# Altium schematic sheet Master MicroController Port C.SchDoc: Master Micro Controller Port C Pin Out
size A4; DocumentNumber: 18; SheetNumber: 18; SheetTotal: 54
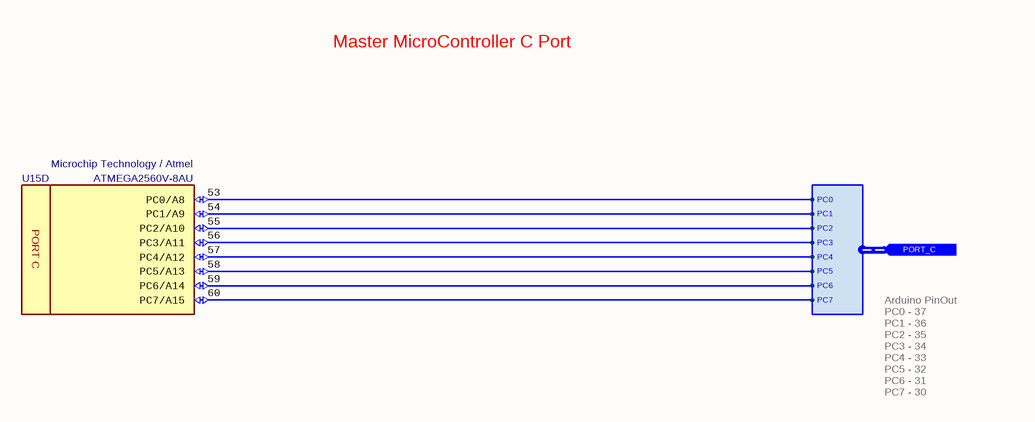
[diagram p0: Master MicroController Port C.SchDoc]

## Parts
U15  Manufacturer Part Number: ATMEGA2560V-8AU  Manufacturer Name: Microchip Technology / Atmel  [TQFP100]  (hidden comment: 8-bit MicroController)  (part D of 15)

## Ports
PORT_C (in, harness PORT_C)

## Harnesses
PORT_C: PC0, PC1, PC2, PC3, PC4, PC5, PC7, PC6

## Nets
NetU15_53: U15.53(PC0/A8) ; port PORT_C.PC0
NetU15_54: U15.54(PC1/A9) ; port PORT_C.PC1
NetU15_55: U15.55(PC2/A10) ; port PORT_C.PC2
NetU15_56: U15.56(PC3/A11) ; port PORT_C.PC3
NetU15_57: U15.57(PC4/A12) ; port PORT_C.PC4
NetU15_58: U15.58(PC5/A13) ; port PORT_C.PC5
NetU15_59: U15.59(PC6/A14) ; port PORT_C.PC6
NetU15_60: U15.60(PC7/A15) ; port PORT_C.PC7

## Notes on the sheet
- Master MicroController C Port
- Arduino PinOut
  PC0 - 37
  PC1 - 36
  PC2 - 35
  PC3 - 34
  PC4 - 33
  PC5 - 32
  PC6 - 31
  PC7 - 30
- Engineer
- All Rights are reserved to Customer and Engineer. [2021]
- Size:
- Date:
- A4
- Project :
- Time:
- Sheet
- of
- Customer
- Product ID
- Module ID
- Version
- File:
- Revision
- (in symbol IC - ATMEGA2560V-8AU, part D) PORT C

## Library data of the parts
U15 = IC - ATMEGA2560V-8AU: 8-bit Microcontrollers - MCU 256kB Flash 4kB EEPROM 86 I/O Pins; Supply Voltage - Min: 2V7; Supply Voltage - Max: 5.5V; Height: 1mm; ComponentLink1Description: DataSheet; ComponentLink1URL: https://eu.mouser.com/datasheet/2/268/Atmel-2549-8-bit-AVR-Microcontroller-ATmega640-128-1315286.pdf; ROHS: Yes; Minimum Operating Temperature: -40; Maximum Operating Temperature: +85; ComponentLink2Description: Mouser; ComponentLink2URL: https://eu.mouser.com/ProductDetail/Microchip-Technology-Atmel/ATMEGA2560V-8AU?qs=sGAEpiMZZMutXGli8Ay4kKlCYcvZUWqJYdtgGFyqFT8%3D; Supplier 1: Digi-Key; Supplier 2: Newark; Supplier 3: Avnet; Supplier 4: RSComponents; Supplier 5: RSComponents; Supplier Part Number 1: ATMEGA2560V-8AU-ND; Supplier Part Number 2: 68T2784; Supplier Part Number 3: 68T2784; Supplier Part Number 4: 1278284P; Supplier Part Number 5: 1278284; Case: TQFP-100; Supplier 6: Mouser; Supplier 7: Future Electronics; Supplier 8: Avnet; Supplier 9: Arrow Electronics; Supplier 10: Farnell; Supplier 11: Allied Electronics; Supplier 12: Future Electronics; Supplier 13: RSComponents; Supplier 14: RSComponents; Supplier 15: RSComponents; Supplier Part Number 6: 556-ATMEGA2560V8AU; Supplier Part Number 7: 4038198; Supplier Part Number 8: ATMEGA2560V-8AU; Supplier Part Number 9: ATMEGA2560V-8AU; Supplier Part Number 10: 1288331; Supplier Part Number 11: 70124009; Supplier Part Number 12: ATMEGA2560V-8AU-TRAY; Supplier Part Number 13: 6963424; Supplier Part Number 14: 6963424P; Supplier Part Number 15: 9220809